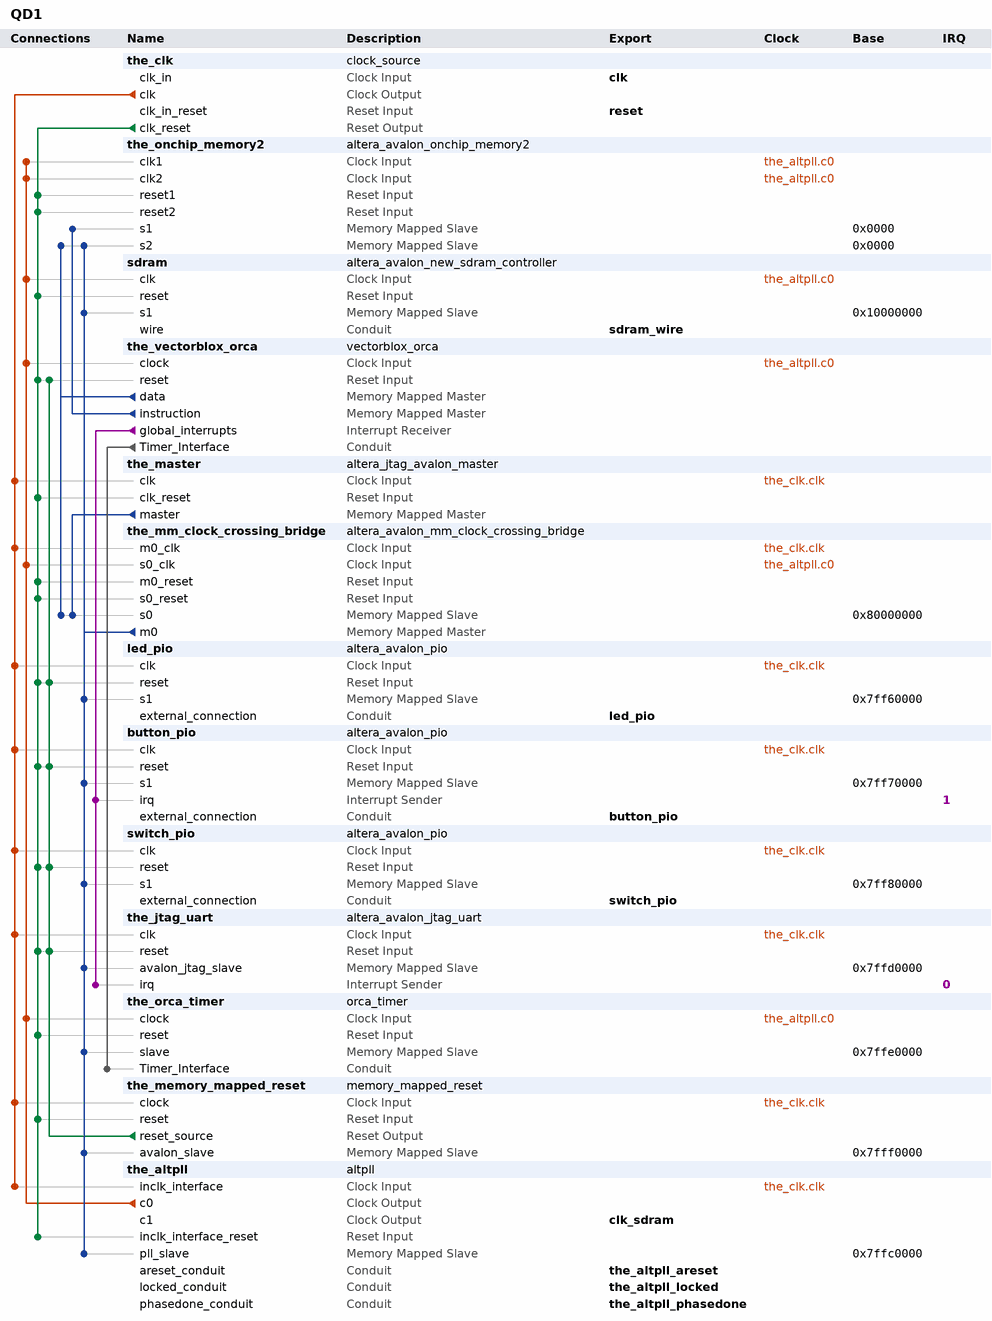
[diagram p0: system contents]
# Platform Designer (Qsys) system QD1, MAX 10 10M08SAE144C8G
# Parameters at their usual value, and those the tool derives, are not listed.
package require -exact qsys 15.1
create_system QD1
set_project_property DEVICE_FAMILY {MAX 10}
set_project_property DEVICE 10M08SAE144C8G

add_instance the_clk clock_source 15.1
set_instance_parameter_value the_clk clockFrequency 50000000

add_instance the_onchip_memory2 altera_avalon_onchip_memory2 15.1
set_instance_parameter_value the_onchip_memory2 dataWidth 32
set_instance_parameter_value the_onchip_memory2 dualPort true
set_instance_parameter_value the_onchip_memory2 initMemContent true
set_instance_parameter_value the_onchip_memory2 initializationFileName software/mem.hex
set_instance_parameter_value the_onchip_memory2 memorySize 32768
set_instance_parameter_value the_onchip_memory2 useNonDefaultInitFile true

add_instance sdram altera_avalon_new_sdram_controller 15.1
set_instance_parameter_value sdram TAC 5.5
set_instance_parameter_value sdram TRCD 20.0
set_instance_parameter_value sdram TRP 20.0
set_instance_parameter_value sdram casLatency 3
set_instance_parameter_value sdram columnWidth 8
set_instance_parameter_value sdram dataWidth 16
set_instance_parameter_value sdram generateSimulationModel true
set_instance_parameter_value sdram model single_Micron_MT48LC4M32B2_7_chip
set_instance_parameter_value sdram numberOfBanks 4
set_instance_parameter_value sdram numberOfChipSelects 1
set_instance_parameter_value sdram powerUpDelay 100.0
set_instance_parameter_value sdram refreshPeriod 15.625
set_instance_parameter_value sdram rowWidth 12

add_instance the_vectorblox_orca vectorblox_orca 1.0
set_instance_parameter_value the_vectorblox_orca AMR0_ADDR_BASE 0
set_instance_parameter_value the_vectorblox_orca AMR0_ADDR_LAST 4294967295
set_instance_parameter_value the_vectorblox_orca AMR0_READ_ONLY 1
set_instance_parameter_value the_vectorblox_orca AUX_MEMORY_REGIONS 1
set_instance_parameter_value the_vectorblox_orca AXI_ID_WIDTH 2
set_instance_parameter_value the_vectorblox_orca BTB_ENTRIES 16
set_instance_parameter_value the_vectorblox_orca DATA_REQUEST_REGISTER 1
set_instance_parameter_value the_vectorblox_orca DATA_RETURN_REGISTER 0
set_instance_parameter_value the_vectorblox_orca DAUX_REQUEST_REGISTER 0
set_instance_parameter_value the_vectorblox_orca DAUX_RETURN_REGISTER 0
set_instance_parameter_value the_vectorblox_orca DCACHE_EXTERNAL_WIDTH 32
set_instance_parameter_value the_vectorblox_orca DCACHE_LINE_SIZE 32
set_instance_parameter_value the_vectorblox_orca DCACHE_SIZE 0
set_instance_parameter_value the_vectorblox_orca DCACHE_WRITEBACK 1
set_instance_parameter_value the_vectorblox_orca DC_REQUEST_REGISTER 1
set_instance_parameter_value the_vectorblox_orca DC_RETURN_REGISTER 0
set_instance_parameter_value the_vectorblox_orca DIVIDE_ENABLE 1
set_instance_parameter_value the_vectorblox_orca DUC_REQUEST_REGISTER 2
set_instance_parameter_value the_vectorblox_orca DUC_RETURN_REGISTER 1
set_instance_parameter_value the_vectorblox_orca ENABLE_EXCEPTIONS 1
set_instance_parameter_value the_vectorblox_orca ENABLE_EXT_INTERRUPTS 1
set_instance_parameter_value the_vectorblox_orca FAMILY ALTERA
set_instance_parameter_value the_vectorblox_orca IAUX_REQUEST_REGISTER 0
set_instance_parameter_value the_vectorblox_orca IAUX_RETURN_REGISTER 0
set_instance_parameter_value the_vectorblox_orca ICACHE_EXTERNAL_WIDTH 32
set_instance_parameter_value the_vectorblox_orca ICACHE_LINE_SIZE 32
set_instance_parameter_value the_vectorblox_orca ICACHE_SIZE 0
set_instance_parameter_value the_vectorblox_orca IC_REQUEST_REGISTER 1
set_instance_parameter_value the_vectorblox_orca IC_RETURN_REGISTER 0
set_instance_parameter_value the_vectorblox_orca INSTRUCTION_REQUEST_REGISTER 0
set_instance_parameter_value the_vectorblox_orca INSTRUCTION_RETURN_REGISTER 0
set_instance_parameter_value the_vectorblox_orca INTERRUPT_VECTOR 4
set_instance_parameter_value the_vectorblox_orca IUC_REQUEST_REGISTER 1
set_instance_parameter_value the_vectorblox_orca IUC_RETURN_REGISTER 0
set_instance_parameter_value the_vectorblox_orca LOG2_BURSTLENGTH 4
set_instance_parameter_value the_vectorblox_orca MAX_IFETCHES_IN_FLIGHT 1
set_instance_parameter_value the_vectorblox_orca MTIME_ENABLE 1
set_instance_parameter_value the_vectorblox_orca MULTIPLY_ENABLE 1
set_instance_parameter_value the_vectorblox_orca NUM_EXT_INTERRUPTS 32
set_instance_parameter_value the_vectorblox_orca PIPELINE_STAGES 4
set_instance_parameter_value the_vectorblox_orca POWER_OPTIMIZED 0
set_instance_parameter_value the_vectorblox_orca REGISTER_SIZE 32
set_instance_parameter_value the_vectorblox_orca RESET_VECTOR 0
set_instance_parameter_value the_vectorblox_orca SHIFTER_MAX_CYCLES 1
set_instance_parameter_value the_vectorblox_orca UC_MEMORY_REGIONS 0
set_instance_parameter_value the_vectorblox_orca UMR0_ADDR_BASE 0
set_instance_parameter_value the_vectorblox_orca UMR0_ADDR_LAST 0
set_instance_parameter_value the_vectorblox_orca UMR0_READ_ONLY 1
set_instance_parameter_value the_vectorblox_orca VCP_ENABLE 0

add_instance the_master altera_jtag_avalon_master 15.1

add_instance the_mm_clock_crossing_bridge altera_avalon_mm_clock_crossing_bridge 15.1
set_instance_parameter_value the_mm_clock_crossing_bridge ADDRESS_WIDTH 31
set_instance_parameter_value the_mm_clock_crossing_bridge COMMAND_FIFO_DEPTH 4
set_instance_parameter_value the_mm_clock_crossing_bridge DATA_WIDTH 32
set_instance_parameter_value the_mm_clock_crossing_bridge MASTER_SYNC_DEPTH 2
set_instance_parameter_value the_mm_clock_crossing_bridge MAX_BURST_SIZE 1
set_instance_parameter_value the_mm_clock_crossing_bridge RESPONSE_FIFO_DEPTH 4
set_instance_parameter_value the_mm_clock_crossing_bridge SLAVE_SYNC_DEPTH 2
set_instance_parameter_value the_mm_clock_crossing_bridge USE_AUTO_ADDRESS_WIDTH 0

add_instance led_pio altera_avalon_pio 15.1
set_instance_parameter_value led_pio direction Output
set_instance_parameter_value led_pio width 8

add_instance button_pio altera_avalon_pio 15.1
set_instance_parameter_value button_pio captureEdge true
set_instance_parameter_value button_pio direction Input
set_instance_parameter_value button_pio edgeType FALLING
set_instance_parameter_value button_pio generateIRQ true
set_instance_parameter_value button_pio irqType EDGE
set_instance_parameter_value button_pio width 4

add_instance switch_pio altera_avalon_pio 15.1
set_instance_parameter_value switch_pio direction Input
set_instance_parameter_value switch_pio width 8

add_instance the_jtag_uart altera_avalon_jtag_uart 15.1
set_instance_parameter_value the_jtag_uart simInteractiveOptions NO_INTERACTIVE_WINDOWS

add_instance the_orca_timer orca_timer 1.0
set_instance_parameter_value the_orca_timer TIMER_WIDTH 32

add_instance the_memory_mapped_reset memory_mapped_reset 1.0
set_instance_parameter_value the_memory_mapped_reset ADDR_WIDTH 2
set_instance_parameter_value the_memory_mapped_reset REGISTER_SIZE 32

add_instance the_altpll altpll 15.1
set_instance_parameter_value the_altpll CLK0_DIVIDE_BY 2
set_instance_parameter_value the_altpll CLK0_MULTIPLY_BY 1
set_instance_parameter_value the_altpll CLK1_DIVIDE_BY 1
set_instance_parameter_value the_altpll CLK1_DUTY_CYCLE 50
set_instance_parameter_value the_altpll CLK1_MULTIPLY_BY 2
set_instance_parameter_value the_altpll CLK1_PHASE_SHIFT -1500
set_instance_parameter_value the_altpll INCLK0_INPUT_FREQUENCY 20000
set_instance_parameter_value the_altpll PORT_ARESET PORT_USED
set_instance_parameter_value the_altpll PORT_LOCKED PORT_USED
set_instance_parameter_value the_altpll PORT_clk1 PORT_USED
set_instance_parameter_value the_altpll PORT_clk2 PORT_UNUSED
set_instance_parameter_value the_altpll PORT_clk3 PORT_UNUSED

# connections
add_connection the_altpll.c0 sdram.clk clock
add_connection the_altpll.c0 the_mm_clock_crossing_bridge.s0_clk clock
add_connection the_altpll.c0 the_onchip_memory2.clk1 clock
add_connection the_altpll.c0 the_onchip_memory2.clk2 clock
add_connection the_altpll.c0 the_orca_timer.clock clock
add_connection the_altpll.c0 the_vectorblox_orca.clock clock
add_connection the_clk.clk button_pio.clk clock
add_connection the_clk.clk led_pio.clk clock
add_connection the_clk.clk switch_pio.clk clock
add_connection the_clk.clk the_altpll.inclk_interface clock
add_connection the_clk.clk the_jtag_uart.clk clock
add_connection the_clk.clk the_master.clk clock
add_connection the_clk.clk the_memory_mapped_reset.clock clock
add_connection the_clk.clk the_mm_clock_crossing_bridge.m0_clk clock
add_connection the_clk.clk_reset button_pio.reset reset
add_connection the_clk.clk_reset led_pio.reset reset
add_connection the_clk.clk_reset sdram.reset reset
add_connection the_clk.clk_reset switch_pio.reset reset
add_connection the_clk.clk_reset the_altpll.inclk_interface_reset reset
add_connection the_clk.clk_reset the_jtag_uart.reset reset
add_connection the_clk.clk_reset the_master.clk_reset reset
add_connection the_clk.clk_reset the_memory_mapped_reset.reset reset
add_connection the_clk.clk_reset the_mm_clock_crossing_bridge.m0_reset reset
add_connection the_clk.clk_reset the_mm_clock_crossing_bridge.s0_reset reset
add_connection the_clk.clk_reset the_onchip_memory2.reset1 reset
add_connection the_clk.clk_reset the_onchip_memory2.reset2 reset
add_connection the_clk.clk_reset the_orca_timer.reset reset
add_connection the_clk.clk_reset the_vectorblox_orca.reset reset
add_connection the_memory_mapped_reset.reset_source button_pio.reset reset
add_connection the_memory_mapped_reset.reset_source led_pio.reset reset
add_connection the_memory_mapped_reset.reset_source switch_pio.reset reset
add_connection the_memory_mapped_reset.reset_source the_jtag_uart.reset reset
add_connection the_memory_mapped_reset.reset_source the_vectorblox_orca.reset reset
add_connection the_master.master the_mm_clock_crossing_bridge.s0 avalon
set_connection_parameter_value the_master.master/the_mm_clock_crossing_bridge.s0 baseAddress 0x80000000
add_connection the_mm_clock_crossing_bridge.m0 button_pio.s1 avalon
set_connection_parameter_value the_mm_clock_crossing_bridge.m0/button_pio.s1 baseAddress 0x7ff70000
add_connection the_mm_clock_crossing_bridge.m0 led_pio.s1 avalon
set_connection_parameter_value the_mm_clock_crossing_bridge.m0/led_pio.s1 baseAddress 0x7ff60000
add_connection the_mm_clock_crossing_bridge.m0 sdram.s1 avalon
set_connection_parameter_value the_mm_clock_crossing_bridge.m0/sdram.s1 baseAddress 0x10000000
add_connection the_mm_clock_crossing_bridge.m0 switch_pio.s1 avalon
set_connection_parameter_value the_mm_clock_crossing_bridge.m0/switch_pio.s1 baseAddress 0x7ff80000
add_connection the_mm_clock_crossing_bridge.m0 the_altpll.pll_slave avalon
set_connection_parameter_value the_mm_clock_crossing_bridge.m0/the_altpll.pll_slave baseAddress 0x7ffc0000
add_connection the_mm_clock_crossing_bridge.m0 the_jtag_uart.avalon_jtag_slave avalon
set_connection_parameter_value the_mm_clock_crossing_bridge.m0/the_jtag_uart.avalon_jtag_slave baseAddress 0x7ffd0000
add_connection the_mm_clock_crossing_bridge.m0 the_memory_mapped_reset.avalon_slave avalon
set_connection_parameter_value the_mm_clock_crossing_bridge.m0/the_memory_mapped_reset.avalon_slave baseAddress 0x7fff0000
add_connection the_mm_clock_crossing_bridge.m0 the_onchip_memory2.s2 avalon
set_connection_parameter_value the_mm_clock_crossing_bridge.m0/the_onchip_memory2.s2 baseAddress 0x0000
add_connection the_mm_clock_crossing_bridge.m0 the_orca_timer.slave avalon
set_connection_parameter_value the_mm_clock_crossing_bridge.m0/the_orca_timer.slave baseAddress 0x7ffe0000
add_connection the_vectorblox_orca.data the_mm_clock_crossing_bridge.s0 avalon
set_connection_parameter_value the_vectorblox_orca.data/the_mm_clock_crossing_bridge.s0 baseAddress 0x80000000
add_connection the_vectorblox_orca.data the_onchip_memory2.s2 avalon
set_connection_parameter_value the_vectorblox_orca.data/the_onchip_memory2.s2 baseAddress 0x0000
add_connection the_vectorblox_orca.instruction the_onchip_memory2.s1 avalon
set_connection_parameter_value the_vectorblox_orca.instruction/the_onchip_memory2.s1 baseAddress 0x0000
add_connection the_vectorblox_orca.Timer_Interface the_orca_timer.Timer_Interface conduit
add_connection the_vectorblox_orca.global_interrupts button_pio.irq interrupt
set_connection_parameter_value the_vectorblox_orca.global_interrupts/button_pio.irq irqNumber 1
add_connection the_vectorblox_orca.global_interrupts the_jtag_uart.irq interrupt
set_connection_parameter_value the_vectorblox_orca.global_interrupts/the_jtag_uart.irq irqNumber 0

# exported interfaces
add_interface button_pio conduit end
set_interface_property button_pio EXPORT_OF button_pio.external_connection
add_interface clk clock sink
set_interface_property clk EXPORT_OF the_clk.clk_in
add_interface clk_sdram clock source
set_interface_property clk_sdram EXPORT_OF the_altpll.c1
add_interface led_pio conduit end
set_interface_property led_pio EXPORT_OF led_pio.external_connection
add_interface reset reset sink
set_interface_property reset EXPORT_OF the_clk.clk_in_reset
add_interface sdram_wire conduit end
set_interface_property sdram_wire EXPORT_OF sdram.wire
add_interface switch_pio conduit end
set_interface_property switch_pio EXPORT_OF switch_pio.external_connection
add_interface the_altpll_areset conduit end
set_interface_property the_altpll_areset EXPORT_OF the_altpll.areset_conduit
add_interface the_altpll_locked conduit end
set_interface_property the_altpll_locked EXPORT_OF the_altpll.locked_conduit
add_interface the_altpll_phasedone conduit end
set_interface_property the_altpll_phasedone EXPORT_OF the_altpll.phasedone_conduit

set_interconnect_requirement {$system} qsys_mm.clockCrossingAdapter HANDSHAKE
set_interconnect_requirement {$system} qsys_mm.enableEccProtection FALSE
set_interconnect_requirement {$system} qsys_mm.insertDefaultSlave FALSE
set_interconnect_requirement {$system} qsys_mm.maxAdditionalLatency 1

save_system QD1.qsys
